# Altium schematic sheet Sheet1.SchDoc: Force Stage
size Tabloid; DocumentNumber: LM-002; Revision: F; SheetNumber: 1; SheetTotal: 2; DocumentName: LM-002; ProjectName: LM-002
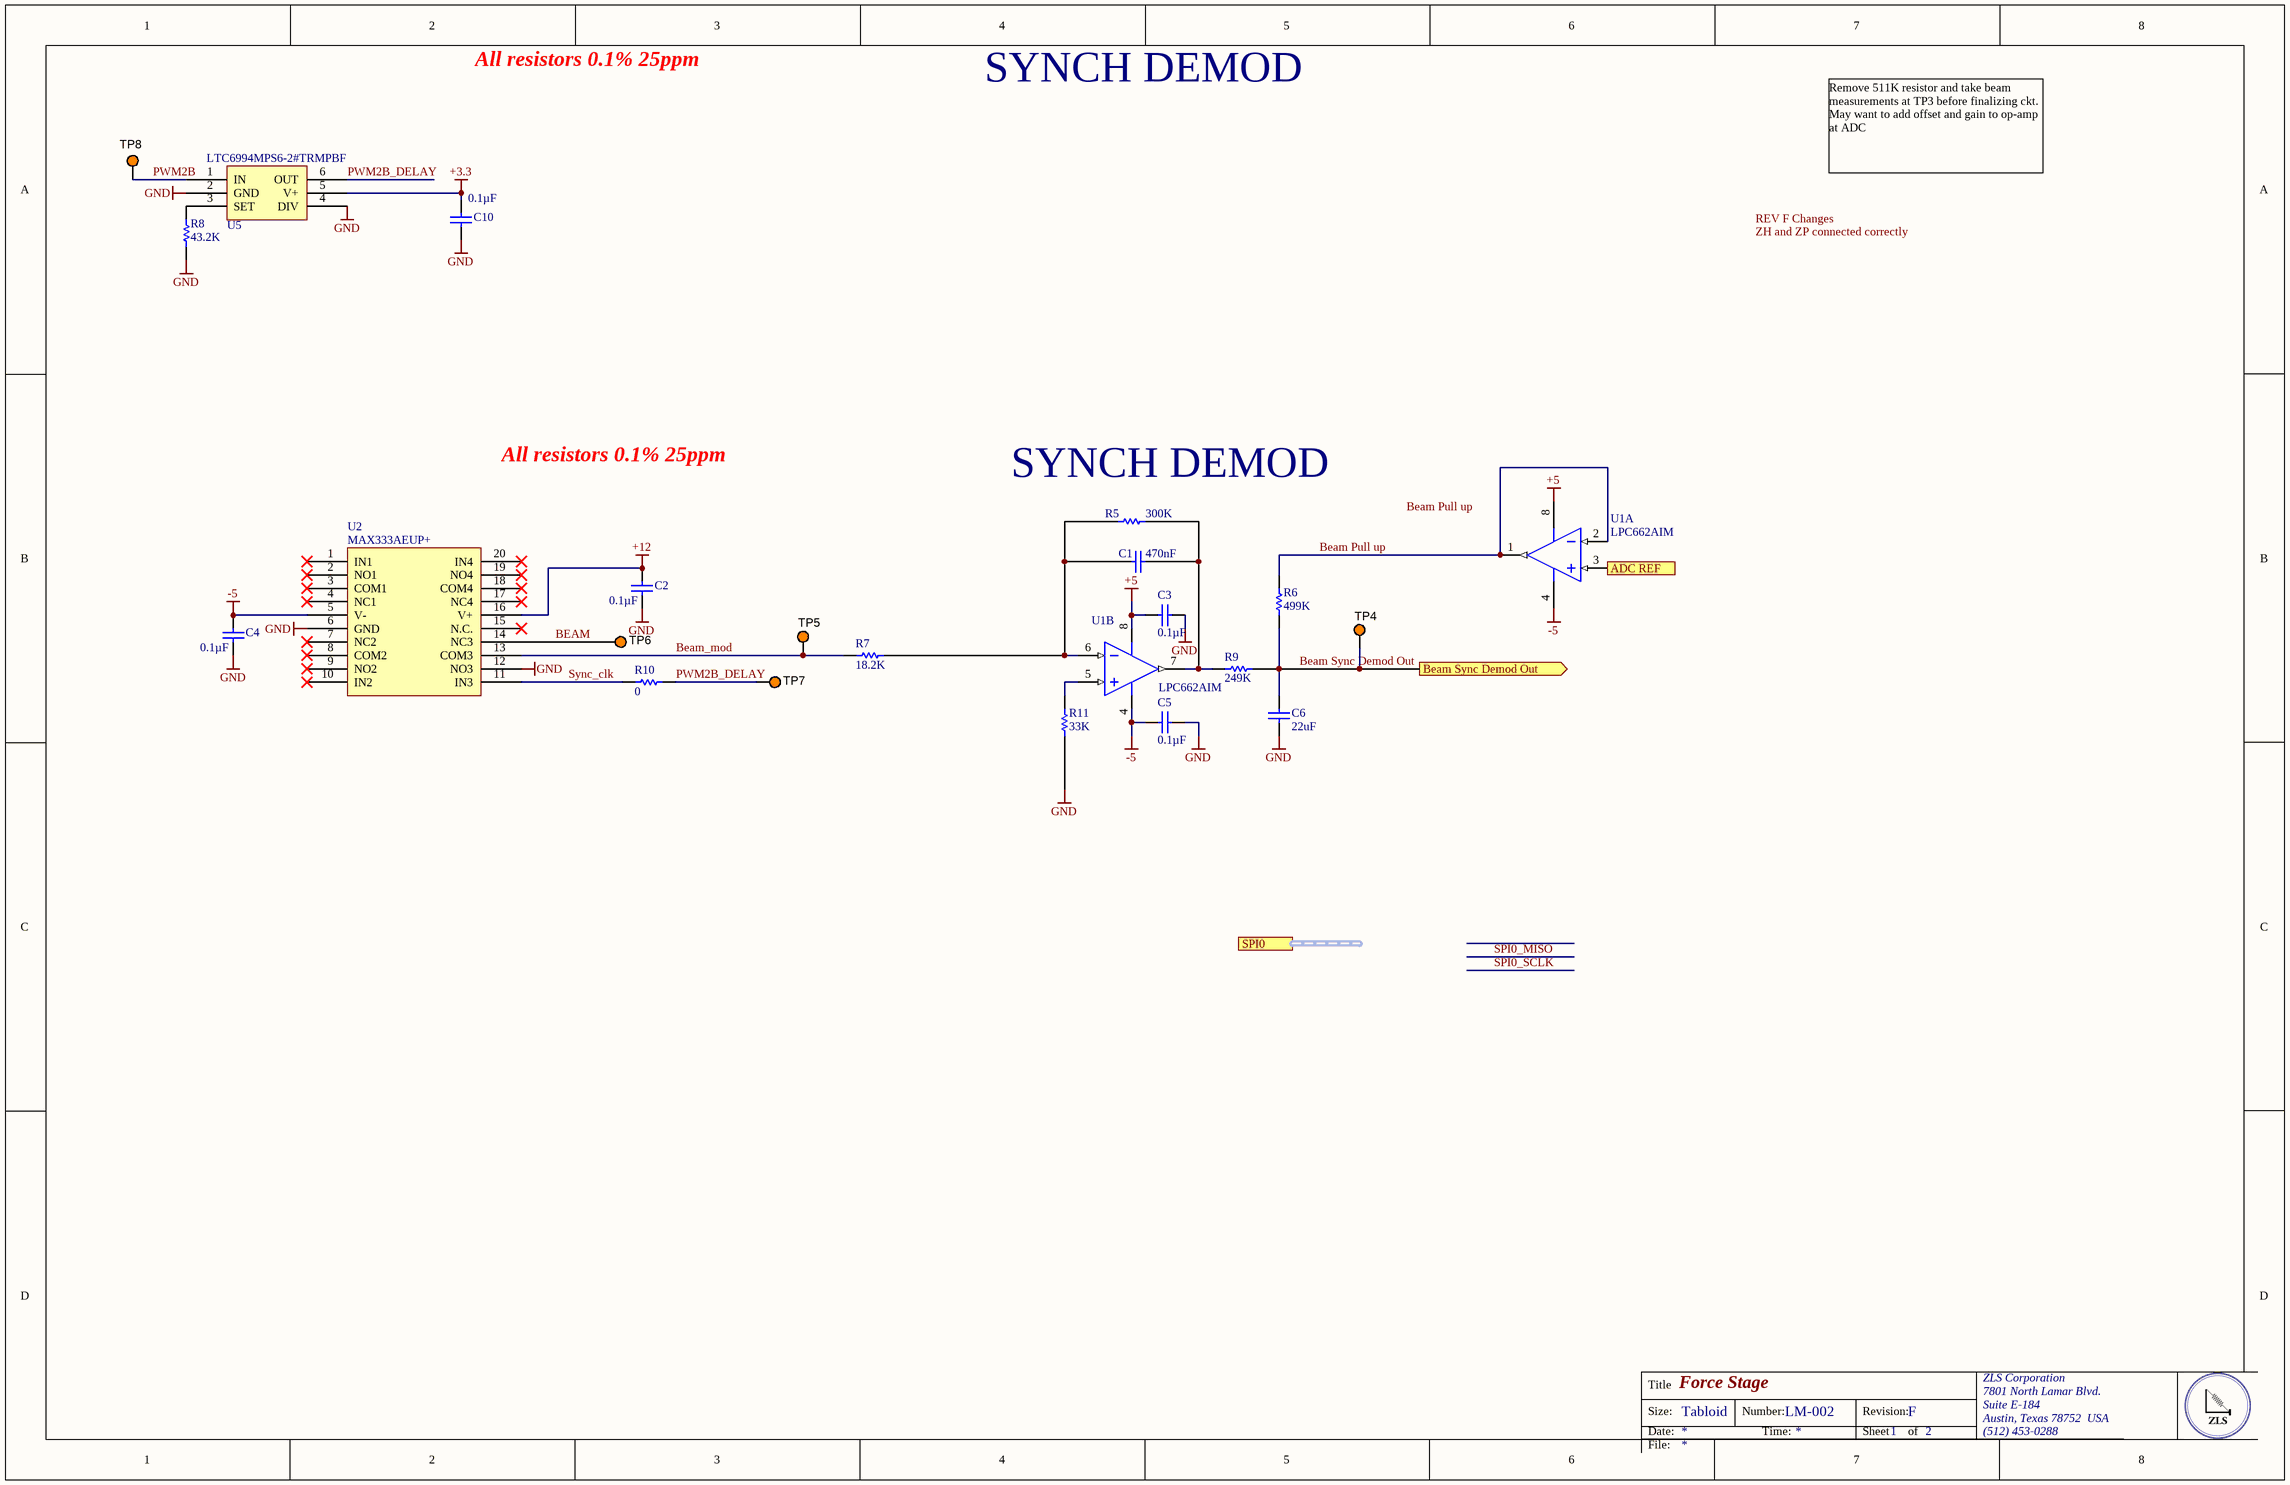
[diagram p0: Sheet1.SchDoc]

## Parts
C1  470nF  [CAPC0805(2012)75_L]
C2  Capacitance: 0.1µF  [CAPC0805(2012)145_N]  (hidden comment: CAP CER 0.1UF 25V X7R 0805)
C3  Capacitance: 0.1µF  [CAPC0805(2012)145_N]  (hidden comment: CAP CER 0.1UF 25V X7R 0805)
C4  Capacitance: 0.1µF  [CAPC0805(2012)145_N]  (hidden comment: CAP CER 0.1UF 25V X7R 0805)
C5  Capacitance: 0.1µF  [CAPC0805(2012)145_N]  (hidden comment: CAP CER 0.1UF 25V X7R 0805)
C6  22uF  [CAPC0805(2012)75_L]
C10  Capacitance: 0.1µF  [CAPC0805(2012)145_N]  (hidden comment: CAP CER 0.1UF 25V X7R 0805)
R5  300K  [RESC0805(2012)_L]
R6  499K  [RESC0805(2012)_L]
R7  18.2K  [RESC0805(2012)_L]
R8  43.2K  [RESC0805(2012)_L]
R9  249K  [RESC0805(2012)_L]
R10  0  [RESC0805(2012)_L]
R11  33K  [RESC0805(2012)_L]
TP4  5003  [KSTN-5003]  (value not drawn)
TP5  5003  [KSTN-5003]  (value not drawn)
TP6  5003  [KSTN-5003]  (value not drawn)
TP7  5003  [KSTN-5003]  (value not drawn)
TP8  5003  [KSTN-5003]  (value not drawn)
U1  LPC662AIM  [D0008A_M]  (parts A,B of 2)
U2  MAX333AEUP+  [TSOP65P640X90-20N]
U5  LTC6994MPS6-2#TRMPBF  [LTC6994MPS6-2#TRMPBF]

## Ports
ADC REF, Beam Sync Demod Out (out), SPI0 (harness SPI0)

## Nets
+3.3: C10.1 U5.5(V+)
+5: C3.1 U1.8(V+)
+12: C2.1 U2.16(V+)
-5: C4.1 C5.1 U1.4(V-) U2.5(V-)
GND: C2.2 C3.2 C4.2 C5.2 C6.1 C10.2 R8.2 R11.1 U2.6(GND) U2.12(NO3) U5.2(GND) U5.4(DIV)
ADC REF: U1.3(INA+) ; port ADC REF
BEAM: TP6.1 U2.14(NC3)
Beam Pull up: R6.2 U1.1(OUTA) U1.2(INA-)
Beam Sync Demod Out: C6.2 R6.1 R9.1 TP4.1 ; port Beam Sync Demod Out
Beam_mod: R7.2 TP5.1 U2.13(COM3)
PWM2B: TP8.1 U5.1(IN)
PWM2B_DELAY: R10.1 TP7.1 U5.6(OUT)
Sync_clk: R10.2 U2.11(IN3)
NetC1_1: C1.1 R5.2 R7.1 U1.6(INB-)
NetC1_2: C1.2 R5.1 R9.2 U1.7(OUTB)
NetR8_1: R8.1 U5.3(SET)
NetR11_2: R11.2 U1.5(INB+)

Not connected (* = marked no-connect by the designer): U2 1(IN1)* 2(NO1)* 3(COM1)* 4(NC1)* 7(NC2)* 8(COM2)* 9(NO2)* 10(IN2)* 15(N.C.)* 17(NC4)* 18(COM4)* 19(NO4)* 20(IN4)*

## Notes on the sheet
- All resistors 0.1% 25ppm
- SYNCH DEMOD
- Remove 511K resistor and take beam measurements at TP3 before finalizing ckt.
  May want to add offset and gain to op-amp at ADC
- (near R5) SYNCH DEMOD
- Labels drawn without touching a wire or pin: Beam Pull up, REV F Changes, ZH and ZP connected correctly
- Title
- Size:
- Date:
- Tabloid
- Number:
- Time:
- Revision:
- Sheet
- of
- ZLS Corporation
- 7801 North Lamar Blvd.
- Suite E-184
- Austin, Texas 78752  USA
- (512) 453-0288
- File:

## Library data of the parts
C1 = CMP-1036-02117-1: CAP CER 0.47UF 25V X7R 0805; Manufacturer: Murata Electronics North America; Manufacturer Part Number: GRM219R71E474KA88D; Tolerance: ±10%; Supplier 1: Digi-Key; Supplier Part Number 1: 490-11584-1-ND; RoHS: RoHS Compliant; Category: Capacitors; Stock 1: 410; Pricing 1: 1=0.38, 10=0.262, 100=0.1573, 500=0.118, 1000=0.09964 (USD); Packaging: Cut Tape (CT); Part Status: Active; Voltage - Rated: 25V; Temperature Coefficient: X7R; Operating Temperature: -55°C ~ 125°C; Features: -; Ratings: -; Applications: General Purpose; Mounting Type: Surface Mount, MLCC; Package / Case: 0805 (2012 Metric); Size / Dimension: 0.079" L x 0.049" W (2.00mm x 1.25mm); Height - Seated (Max): -; Thickness (Max): 0.037" (0.95mm); Lead Spacing: -; Lead Style: -; ComponentLink1URL: https://www.murata.com/~/media/webrenewal/support/library/catalog/products/capacitor/mlcc/c02e.ashx?la=en-us; ComponentLink1Description: https://www.murata.com/~/media/webrenewal/support/library/catalog/products/capacitor/mlcc/c02e.ashx?la=en-us
C2-C5 C10 = CMP-1036-04795-1: Manufacturer: Murata Electronics North America; Manufacturer Part Number: GRM21BR71E104KA01L; Tolerance: ±10%; Supplier 1: Digi-Key; Supplier Part Number 1: 490-1673-6-ND; RoHS: RoHS Compliant; Category: Capacitors; Stock 1: 891652; Pricing 1: 1=0.2, 10=0.145, 100=0.0683, 500=0.04788, 1000=0.03964 (USD); Packaging: Digi-Reel®; Part Status: Active; Voltage - Rated: 25V; Temperature Coefficient: X7R; Operating Temperature: -55°C ~ 125°C; Features: -; Ratings: -; Applications: General Purpose; Mounting Type: Surface Mount, MLCC; Package / Case: 0805 (2012 Metric); Size / Dimension: 0.079" L x 0.049" W (2.00mm x 1.25mm); Height - Seated (Max): -; Thickness (Max): 0.053" (1.35mm); Lead Spacing: -; Lead Style: -; ComponentLink1URL: http://www.murata.com/~/media/webrenewal/support/library/catalog/products/capacitor/mlcc/c02e.ashx; ComponentLink1Description: http://www.murata.com/~/media/webrenewal/support/library/catalog/products/capacitor/mlcc/c02e.ashx
C6 = CMP-1036-02117-1: CAP CER 22UF 25V X5R 0805; Manufacturer: Murata Electronics North America; Manufacturer Part Number: GRM21BR61E226ME44L; Tolerance: ±20%; Notification: Current market demand for these product types have resulted in fluctuating and extending lead times. Lead times may differ.; Supplier 1: Digi-Key; Supplier Part Number 1: 490-10749-1-ND; RoHS: RoHS Compliant; Category: Capacitors; Stock 1: 2004; Pricing 1: 1=0.57, 10=0.404, 100=0.2663, 500=0.19722, 1000=0.16764 (USD); Packaging: Cut Tape (CT); Part Status: Active; Voltage - Rated: 25V; Temperature Coefficient: X5R; Operating Temperature: -55°C ~ 85°C; Features: -; Ratings: -; Applications: General Purpose; Mounting Type: Surface Mount, MLCC; Package / Case: 0805 (2012 Metric); Size / Dimension: 0.079" L x 0.049" W (2.00mm x 1.25mm); Height - Seated (Max): -; Thickness (Max): 0.057" (1.45mm); Lead Spacing: -; Lead Style: -; ComponentLink1URL: http://search.murata.co.jp/Ceramy/image/img/A01X/G101/ENG/GRM21BR61E226ME44-01.pdf; ComponentLink1Description: http://search.murata.co.jp/Ceramy/image/img/A01X/G101/ENG/GRM21BR61E226ME44-01.pdf
R5 = CMP-1013-00215-1: RES SMD 300K OHM 1% 1/8W 0805; Manufacturer: Vishay Dale; Manufacturer Part Number: CRCW0805300KFKEAHP; Power (Watts): 0.5W, 1/2W; Temperature Coefficient: ±100ppm/°C; Supplier 1: Digi-Key; Supplier Part Number 1: 541-300KTCT-ND; RoHS: RoHS Compliant; Category: Resistors; Stock 1: 3851; Pricing 1: 1=0.28, 10=0.233, 100=0.0911, 1000=0.03812, 2500=0.03494 (USD); Packaging: Cut Tape (CT); Part Status: Active; Tolerance: ±1%; Composition: Thick Film; Features: Automotive AEC-Q200, Pulse Withstanding; Operating Temperature: -55°C ~ 155°C; Package / Case: 0805 (2012 Metric); Supplier Device Package: 0805; Size / Dimension: 0.079" L x 0.049" W (2.00mm x 1.25mm); Height - Seated (Max): 0.020" (0.50mm); Failure Rate: -; ComponentLink1URL: http://www.vishay.com/docs/20043/crcwhpe3.pdf; ComponentLink1Description: http://www.vishay.com/docs/20043/crcwhpe3.pdf
R6 = CMP-1013-00215-1: RES SMD 499K OHM 0.1% 1/8W 0805; Manufacturer: Panasonic Electronic Components; Manufacturer Part Number: ERA-6AEB4993V; Power (Watts): 0.125W, 1/8W; Temperature Coefficient: ±25ppm/°C; Supplier 1: Digi-Key; Supplier Part Number 1: P499KDACT-ND; RoHS: RoHS Compliant; Category: Resistors; Stock 1: 125602; Pricing 1: 1=0.36, 10=0.302, 100=0.1182, 1000=0.04948, 2500=0.04536 (USD); Packaging: Cut Tape (CT); Part Status: Active; Tolerance: ±0.1%; Composition: Thin Film; Features: Automotive AEC-Q200; Operating Temperature: -55°C ~ 155°C; Package / Case: 0805 (2012 Metric); Supplier Device Package: 0805; Size / Dimension: 0.079" L x 0.049" W (2.00mm x 1.25mm); Height - Seated (Max): 0.024" (0.60mm); Failure Rate: -; ComponentLink1URL: https://industrial.panasonic.com/cdbs/www-data/pdf/RDM0000/AOA0000C307.pdf; ComponentLink1Description: https://industrial.panasonic.com/cdbs/www-data/pdf/RDM0000/AOA0000C307.pdf
R7 = CMP-1013-00215-1: RES SMD 18.2K OHM 1% 1/8W 0805; Manufacturer: Panasonic Electronic Components; Manufacturer Part Number: ERJ-6ENF1822V; Power (Watts): 0.125W, 1/8W; Temperature Coefficient: ±100ppm/°C; Supplier 1: Digi-Key; Supplier Part Number 1: P18.2KCCT-ND; RoHS: RoHS Compliant; Category: Resistors; Stock 1: 116820; Pricing 1: 1=0.1, 10=0.079, 100=0.0305, 1000=0.0134, 2500=0.01157 (USD); Packaging: Cut Tape (CT); Part Status: Active; Tolerance: ±1%; Composition: Thick Film; Features: Automotive AEC-Q200; Operating Temperature: -55°C ~ 155°C; Package / Case: 0805 (2012 Metric); Supplier Device Package: 0805; Size / Dimension: 0.079" L x 0.049" W (2.00mm x 1.25mm); Height - Seated (Max): 0.028" (0.70mm); Failure Rate: -; ComponentLink1URL: https://industrial.panasonic.com/cdbs/www-data/pdf/RDA0000/AOA0000C304.pdf; ComponentLink1Description: https://industrial.panasonic.com/cdbs/www-data/pdf/RDA0000/AOA0000C304.pdf
R8 = CMP-1013-00215-1: RES SMD 43.2K OHM 1% 1/8W 0805; Manufacturer: Vishay Dale; Manufacturer Part Number: CRCW080543K2FKEA; Power (Watts): 0.125W, 1/8W; Temperature Coefficient: ±100ppm/°C; Supplier 1: Digi-Key; Supplier Part Number 1: 541-43.2KCCT-ND; RoHS: RoHS Compliant; Category: Resistors; Stock 1: 68577; Pricing 1: 1=0.1, 10=0.055, 100=0.0223, 1000=0.01003, 2500=0.0087 (USD); Packaging: Cut Tape (CT); Part Status: Active; Tolerance: ±1%; Composition: Thick Film; Features: Automotive AEC-Q200; Operating Temperature: -55°C ~ 155°C; Package / Case: 0805 (2012 Metric); Supplier Device Package: 0805; Size / Dimension: 0.079" L x 0.049" W (2.00mm x 1.25mm); Height - Seated (Max): 0.020" (0.50mm); Failure Rate: -; ComponentLink1URL: http://www.vishay.com/docs/20035/dcrcwe3.pdf; ComponentLink1Description: http://www.vishay.com/docs/20035/dcrcwe3.pdf
R9 = CMP-1013-00215-1: RES SMD 249K OHM 0.1% 1/8W 0805; Manufacturer: Panasonic Electronic Components; Manufacturer Part Number: ERA-6AEB2493V; Power (Watts): 0.125W, 1/8W; Temperature Coefficient: ±25ppm/°C; Supplier 1: Digi-Key; Supplier Part Number 1: P249KDACT-ND; RoHS: RoHS Compliant; Category: Resistors; Stock 1: 18568; Pricing 1: 1=0.36, 10=0.302, 100=0.1182, 1000=0.04948, 2500=0.04536 (USD); Packaging: Cut Tape (CT); Part Status: Active; Tolerance: ±0.1%; Composition: Thin Film; Features: Automotive AEC-Q200; Operating Temperature: -55°C ~ 155°C; Package / Case: 0805 (2012 Metric); Supplier Device Package: 0805; Size / Dimension: 0.079" L x 0.049" W (2.00mm x 1.25mm); Height - Seated (Max): 0.024" (0.60mm); Failure Rate: -; ComponentLink1URL: https://industrial.panasonic.com/cdbs/www-data/pdf/RDM0000/AOA0000C307.pdf; ComponentLink1Description: https://industrial.panasonic.com/cdbs/www-data/pdf/RDM0000/AOA0000C307.pdf
R10 = CMP-1013-00215-1: RES SMD 0 OHM JUMPER 1/8W 0805; Manufacturer: Panasonic Electronic Components; Manufacturer Part Number: ERJ-6GEY0R00V; Power (Watts): 0.125W, 1/8W; Supplier 1: Digi-Key; Supplier Part Number 1: P0.0ACT-ND; RoHS: RoHS Compliant; Category: Resistors; Stock 1: 3414819; Pricing 1: 1=0.1, 10=0.074, 25=0.0532, 50=0.0406, 100=0.03, 250=0.02288, 500=0.0183, 1000=0.01347 (USD); Packaging: Cut Tape (CT); Part Status: Active; Tolerance: Jumper; Composition: Thick Film; Features: Automotive AEC-Q200; Temperature Coefficient: -; Operating Temperature: -55°C ~ 155°C; Package / Case: 0805 (2012 Metric); Supplier Device Package: 0805; Size / Dimension: 0.079" L x 0.049" W (2.00mm x 1.25mm); Height - Seated (Max): 0.028" (0.70mm); Failure Rate: -; ComponentLink1URL: http://industrial.panasonic.com/www-cgi/jvcr13pz.cgi?E+PZ+3+AOA0001+ERJ6GEY0R00V+7+WW; ComponentLink1Description: http://industrial.panasonic.com/www-cgi/jvcr13pz.cgi?E+PZ+3+AOA0001+ERJ6GEY0R00V+7+WW
R11 = CMP-1013-00215-1: RES SMD 33K OHM 1% 1/2W 0805; Manufacturer: Vishay Dale; Manufacturer Part Number: CRCW080533K0FKEAHP; Power (Watts): 0.5W, 1/2W; Temperature Coefficient: ±100ppm/°C; Supplier 1: Digi-Key; Supplier Part Number 1: 541-33.0KTCT-ND; RoHS: RoHS Compliant; Category: Resistors; Stock 1: 2026; Pricing 1: 1=0.28, 10=0.233, 100=0.0911, 1000=0.03812, 2500=0.03494 (USD); Packaging: Cut Tape (CT); Part Status: Active; Tolerance: ±1%; Composition: Thick Film; Features: Automotive AEC-Q200, Pulse Withstanding; Operating Temperature: -55°C ~ 155°C; Package / Case: 0805 (2012 Metric); Supplier Device Package: 0805; Size / Dimension: 0.079" L x 0.049" W (2.00mm x 1.25mm); Height - Seated (Max): 0.020" (0.50mm); Failure Rate: -; ComponentLink1URL: http://www.vishay.com/docs/20043/crcwhpe3.pdf; ComponentLink1Description: http://www.vishay.com/docs/20043/crcwhpe3.pdf
TP4-TP8 = CMP-1672-00009-1: Test Point, Orange, 1-Pin THD, RoHS; Peak Reverse Current: 600 uA; Forward Current: 3 A; Max Surge Current: 80 A; Forward Voltage: 1.08 V; Max Operating Temperature: 150 degC; PackageReference: 5003; Pins: 2; ComponentLink2URL: http://keyelco.com/userAssets/file/M65p56.pdf; PackageDescription: 1-Pin Through Hole Device, Dia 2.54 mm; Weight: 0.01 lb; Diameter: 5.3 mm; Mount: Through Hole; Package Quantity: 500; Packaging: Bulk; Min Operating Temperature: -65 degC; ComponentLink1Description: Manufacturer URL; Height: 0.25 inch; ComponentLink1URL: http://www.keyelco.com/; ComponentLink2Description: Datasheet; Width: 0.25 inch; REACH SVHC: No SVHC; RoHSCompliant: true; Radiation Hardening: No; Length: 9.5 mm; DatasheetVersion: Jun-15
U1 = CMP-0055-00867-3: Low Power CMOS Dual Operational Amplifier, 8-pin Narrow SOIC; Manufacturer: Texas Instruments; Manufacturer Part Number: LPC662AIM/NOPB; Amplifier Type: General Purpose; Output Type: Rail-to-Rail; Slew Rate: 0.11 V/µs; Current - Supply: 86µA; Voltage - Supply, Single/Dual (±): 4.75 V ~ 15.5 V, ±2.38 V ~ 7.75 V; Supplier 1: Digi-Key; Supplier Part Number 1: LPC662AIM/NOPB-ND; RoHS: RoHS Compliant; Category: Integrated Circuits (ICs); Stock 1: 319; Pricing 1: 1=3.4, 95=2.88905, 190=2.50379, 570=2.13144, 1045=1.7976 (USD); Packaging: Tube; Part Status: Active; Operating Temperature: -40°C ~ 85°C; Mounting Type: Surface Mount; Package / Case: 8-SOIC (0.154", 3.90mm Width); Supplier Device Package: 8-SOIC; Base Part Number: LPC662; ComponentLink1URL: http://www.ti.com/lit/ds/symlink/lpc662.pdf; ComponentLink1Description: http://www.ti.com/lit/ds/symlink/lpc662.pdf
U2 = MAX333CWP+: IC SWITCH QUAD SPDT 20TSSOP; Manufacturer: Maxim Integrated; Multiplexer/Demultiplexer Circuit: 2:1; On-State Resistance (Max): 45 Ohm; Channel-to-Channel Matching (&Delta;Ron): 2 Ohm (Max); Voltage - Supply, Single (V+): 10 V ~ 30 V; Voltage - Supply, Dual (V±): ±4.5 V ~ 20 V; Switch Time (Ton, Toff) (Max): 175ns, 145ns; Charge Injection: 2pC; Channel Capacitance (CS(off), CD(off)): 5pF; Current - Leakage (IS(off)) (Max): 250pA; Crosstalk: -78dB @ 1MHz; Supplier 1: Digi-Key; Supplier Part Number 1: MAX333AEUP+-ND; Manufacturer Part Number: MAX333AEUP+; RoHS: RoHS Compliant; Category: Integrated Circuits (ICs); Stock 1: 1328; Pricing 1: 1=6.77, 10=6.432, 25=6, 50=5.8942 (USD); Packaging: Tube; Part Status: Active; Switch Circuit: SPDT; -3db Bandwidth: -; Operating Temperature: -40°C ~ 85°C (TA); Package / Case: 20-TSSOP (0.173", 4.40mm Width); Supplier Device Package: 20-TSSOP; Base Part Number: MAX333; ComponentLink1URL: https://pdfserv.maximintegrated.com/en/ds/MAX333A.pdf; ComponentLink1Description: https://pdfserv.maximintegrated.com/en/ds/MAX333A.pdf
U5 = LTC6994MPS6-2#TRMPBF: IC DELAY BLOCK 8TAP PROG TSOT23; Manufacturer: Linear Technology/Analog Devices; Manufacturer Part Number: LTC6994CS6-2#TRMPBF; Function: Programmable; Available Total Delays: 1µs ~ 33.6s; Voltage - Supply: 2.25 V ~ 5.5 V; Supplier 1: Digi-Key; Supplier Part Number 1: LTC6994CS6-2#TRMPBFCT-ND; RoHS: RoHS Compliant; Category: Integrated Circuits (ICs); Stock 1: 1401; Pricing 1: 1=3.42, 25=3.0496, 100=1.9217, 250=1.76156 (USD); Packaging: Cut Tape (CT); Part Status: Active; Delay to 1st Tap: -; Operating Temperature: 0°C ~ 70°C; Mounting Type: Surface Mount; Package / Case: SOT-23-6 Thin, TSOT-23-6; Supplier Device Package: TSOT-23-6; Base Part Number: LTC6994; ComponentLink1URL: http://www.linear.com/docs/29725; ComponentLink1Description: http://www.linear.com/docs/29725